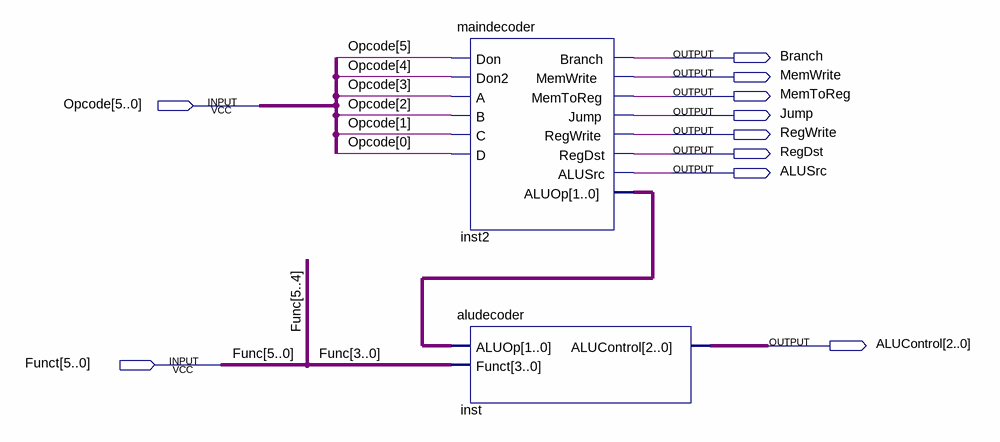
[diagram p0: schematic sheet]
// Quartus schematic controlunit.bdf as structural Verilog: 2 symbols, 10 pins
module controlunit (
  input  [5:0] Opcode,
  input  [5:0] Funct,
  output Branch,
  output MemWrite,
  output MemToReg,
  output Jump,
  output RegWrite,
  output RegDst,
  output ALUSrc,
  output [2:0] ALUControl
);

  wire [1:0] inst2_aluop;

  maindecoder inst2 (
    .Don(Opcode[5]), .Don2(Opcode[4]), .A(Opcode[3]), .B(Opcode[2]), .C(Opcode[1]), .D(Opcode[0]),
    .Branch(Branch), .MemWrite(MemWrite), .MemToReg(MemToReg), .Jump(Jump), .RegWrite(RegWrite),
    .RegDst(RegDst), .ALUSrc(ALUSrc), .ALUOp(inst2_aluop));
  aludecoder inst (.ALUOp(inst2_aluop), .Funct(Funct[3:0]), .ALUControl(ALUControl));

  // Other names for the same wires on the sheet: Func[5:0] = Funct
endmodule
